# Altium schematic sheet Display.SchDoc
size A4; SheetNumber: 2; SheetTotal: 5
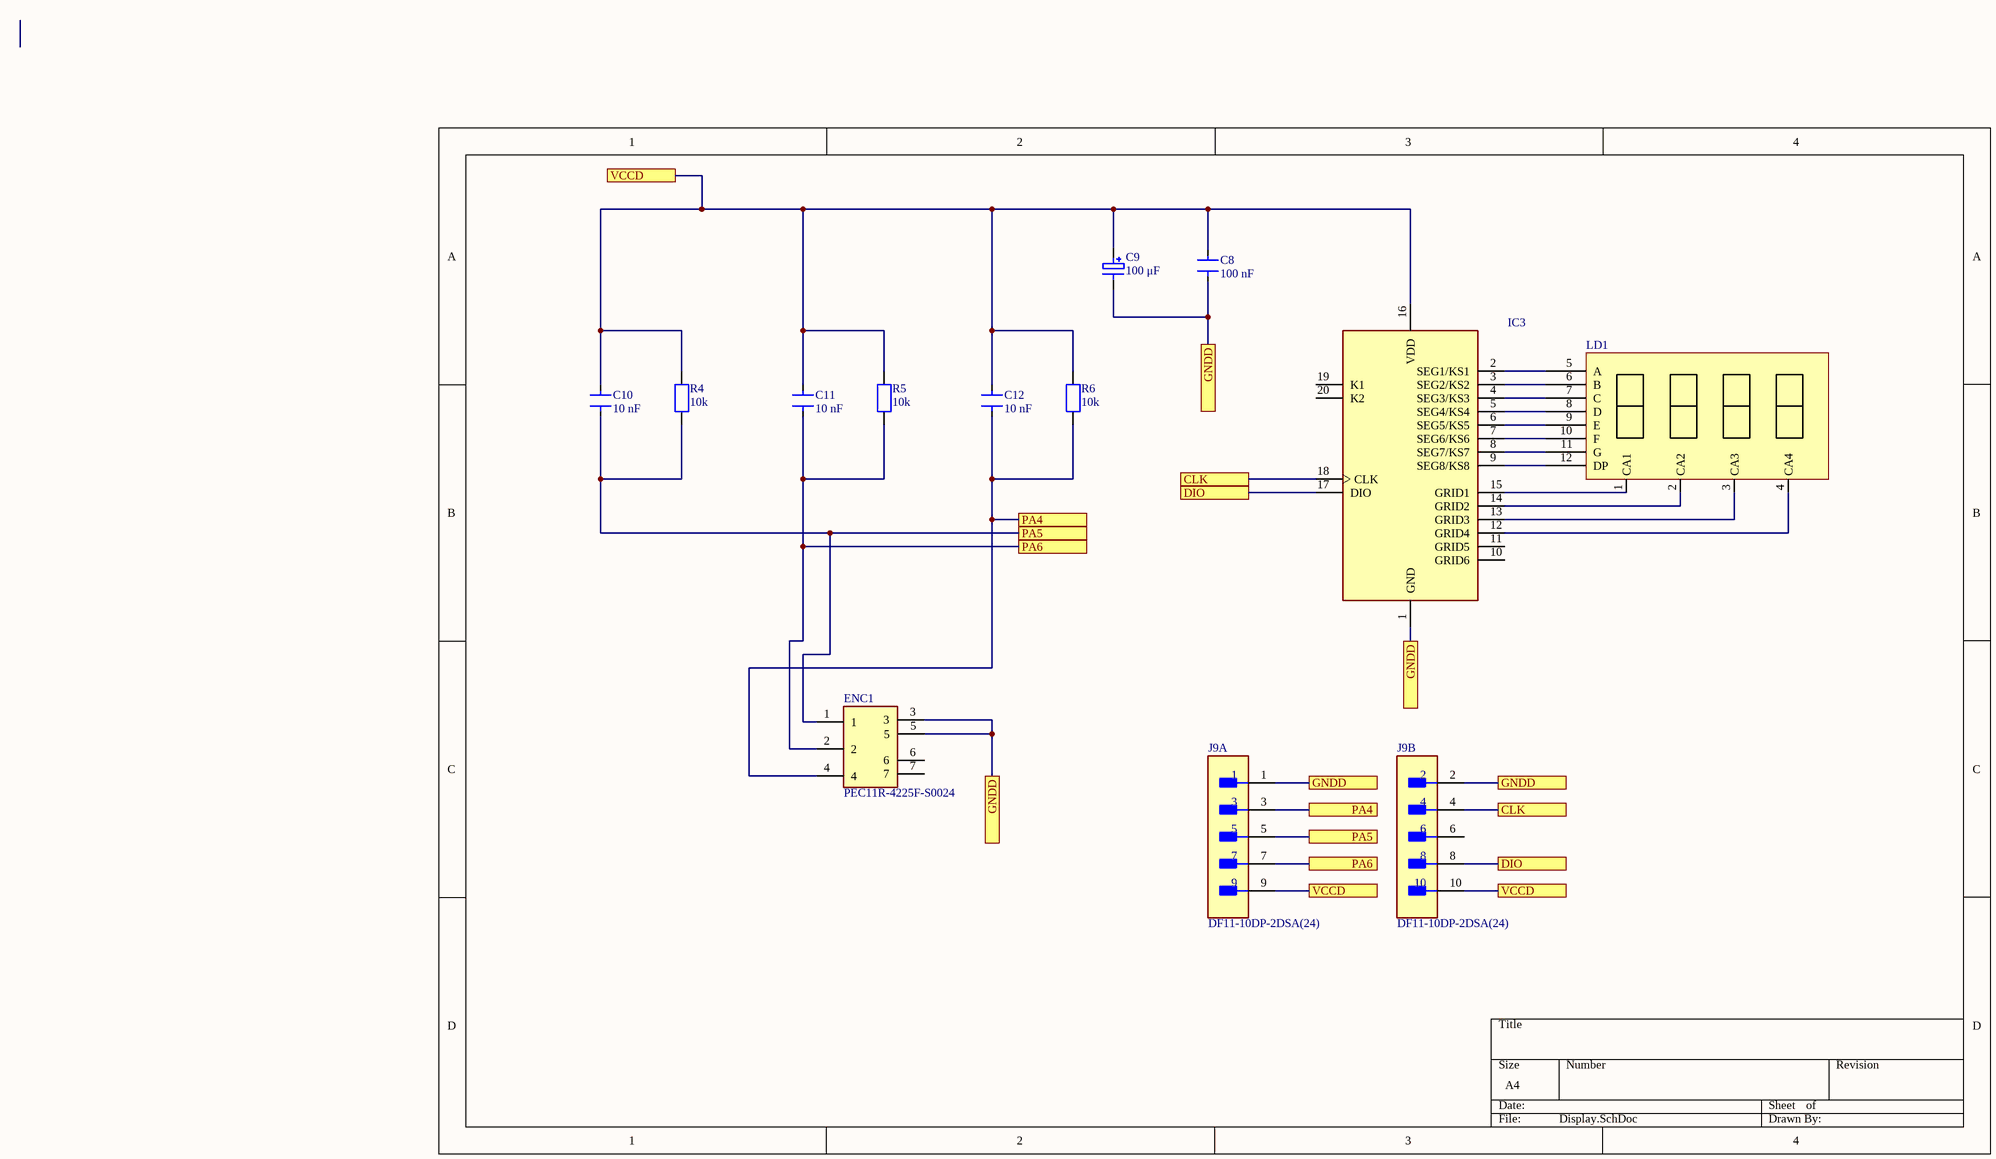
[diagram p0: Display.SchDoc]

## Parts
C8  100 nF  [0805]
C9  100 μF  [Elco 100uF 25V]
C10  10 nF  [0805]
C11  10 nF  [0805]
C12  10 nF  [0805]
ENC1  PEC11R-4225F-S0024  [Encoder]
IC3  TM1637  [TM1637]  (value not drawn)
J9  DF11-10DP-2DSA(24)  [FP-DF11-10DP-2DSA_24-MFG]  (parts A,B of 2)
LD1  7segment  [7segment]  (value not drawn)
R4  10k  [Resistor]
R5  10k  [Resistor]
R6  10k  [Resistor]

## Ports
CLK (see Display[2B]), CLK (see Display[3C]), DIO (see Display[2B]), DIO (see Display[3C]), GNDD (see Display[2B], Display[2C], Display[3C]), GNDD (see Display[2B], Display[3C]), GNDD (see Display[2C], Display[3C]), PA4 (see Display[2B]), PA4 (see Display[3C]), PA5 (see Display[2B]), PA5 (see Display[3C]), PA6 (see Display[2B]), PA6 (see Display[3C]), VCCD (see Display[1A], Display[3C]), VCCD (see Display[3C])

## Nets
CLK: IC3.18(CLK) J9.4 ; port CLK
DIO: IC3.17(DIO) J9.8 ; port DIO
GNDD: C8.1 C9.2 ENC1.3 ENC1.5 IC3.1(GND) J9.1 J9.2 ; port GNDD
PA4: C12.1 ENC1.4 J9.3 R6.1 ; port PA4
PA5: C10.1 ENC1.1 J9.5 R4.1 ; port PA5
PA6: C11.1 ENC1.2 J9.7 R5.1 ; port PA6
VCCD: C8.2 C9.1 C10.2 C11.2 C12.2 IC3.16(VDD) J9.9 J9.10 R4.2 R5.2 R6.2 ; port VCCD
NetIC3_2: IC3.2(SEG1/KS1) LD1.5(A)
NetIC3_3: IC3.3(SEG2/KS2) LD1.6(B)
NetIC3_4: IC3.4(SEG3/KS3) LD1.7(C)
NetIC3_5: IC3.5(SEG4/KS4) LD1.8(D)
NetIC3_6: IC3.6(SEG5/KS5) LD1.9(E)
NetIC3_7: IC3.7(SEG6/KS6) LD1.10(F)
NetIC3_8: IC3.8(SEG7/KS7) LD1.11(G)
NetIC3_9: IC3.9(SEG8/KS8) LD1.12(DP)
NetIC3_12: IC3.12(GRID4) LD1.4(CA4)
NetIC3_13: IC3.13(GRID3) LD1.3(CA3)
NetIC3_14: IC3.14(GRID2) LD1.2(CA2)
NetIC3_15: IC3.15(GRID1) LD1.1(CA1)

Not connected (* = marked no-connect by the designer): ENC1 6 7; IC3 10(GRID6) 11(GRID5) 19(K1) 20(K2); J9 6

## Library data of the parts
C8 C10-C12 = Condensator 0805: Chip Multilayer Ceramic Capacitors for General Purpose, 0805, 10uF, X5R, 15%, 10%, 25V; Length: 2mm; Depth: 1.25mm; Termination: SMD/SMT; Voltage: 25V; Height: 1.25mm; Material: Ceramic; Thickness: 0.053inch; Radiation Hardening: No; Min Operating Temperature: -55°C; Width: 0.049inch; Package Quantity: 1; Mount: Surface Mount; Dielectric: X5R; Packaging: Tape and Reel; Capacitance: 10uF; Voltage Rating (DC): 25V; Lead Free: Lead Free; Max Operating Temperature: 85°C; Case Code (Imperial): 0805; Case/Package: 0805; Tolerance: 10%; Voltage Rating: 25V; Case Code (Metric): 2012
C9 = Condensator Elco: Part Number: 02015A270JAT2A; Manufacturer: AVX Interconnect / Elco
ENC1 = Encoder: Undefined or Miscellaneous; Manufacturer_Name: Bourns; Datasheet Link: https://componentsearchengine.com//PEC11R-4225F-S0024.pdf; Mouser2 Part Number: 652-PEC11R-4225F-S24; Mouser2 Price/Stock: https://www.mouser.com/Search/Refine.aspx?Keyword=652-PEC11R-4225F-S24; Manufacturer_Part_Number: PEC11R-4225F-S0024
IC3 = TM1637: LED Drive Control Special Circuit; MF: Titan Micro Electronics; Package: Package; Availability: Not in stock; SnapEDA_Link: https://www.snapeda.com/parts/TM1637/Titan+Micro+Electronics/view-part/?ref=snap; MP: TM1637; Check_prices: https://www.snapeda.com/parts/TM1637/Titan+Micro+Electronics/view-part/?ref=eda; Value: *; Price: None
J9 = CMP-11610-000008-1: CONN HEADER VERT 10POS 2MM; Manufacturer: Hirose; Number Of Contacts: 10; Voltage Rating: 250V; Conn Orientation: Straight; Conn Gender: Male; Current Rating: 2A; Temperature Range High: +85°C; RoHS: TRUE; Device Class L2: Headers and Wire Housings; ComponentLink2URL: https://www.hirose.com/product/document?clcode=CL0543-0520-0-24&productname=DF11-10DP-2DSA(24)&series=DF11&documenttype=Catalog&lang=en&documentid=D31688_en; Height: 6.9mm; Package: DF11-10DP-2DSA(24); ComponentLink2Description: Datasheet; Automotive: No; Digikey Description: CONN HEADER VERT 10POS 2MM; Manufacturer Part Number: DF11-10DP-2DSA(24); Temperature: -40°C to +85°C; Octopart: https://octopart.com/df11-10dp-2dsa%2824%29-hirose-39521433; Number Of Rows: 2; Device Class L3: unset; Contact Material: Tin,Nickel; Mouser Description: Headers & Wire Housings 10P STRT HEADER THRU HL,BD MNT,SN; Category: Conn; Device Class L1: Connectors; Temperature Range Low: -40°C; Pitch: 2mm; Lead Free: Yes; Footprint Url: https://www.hirose.com/product/document?clcode=CL0543-0520-0-24&productname=DF11-10DP-2DSA(24)&series=DF11&documenttype=2DDrawing&lang=en&documentid=0000995333
R4-R6 = Resistor: Manufacturer: Vishay Dale; Part Number: CRCW08050000Z0EA